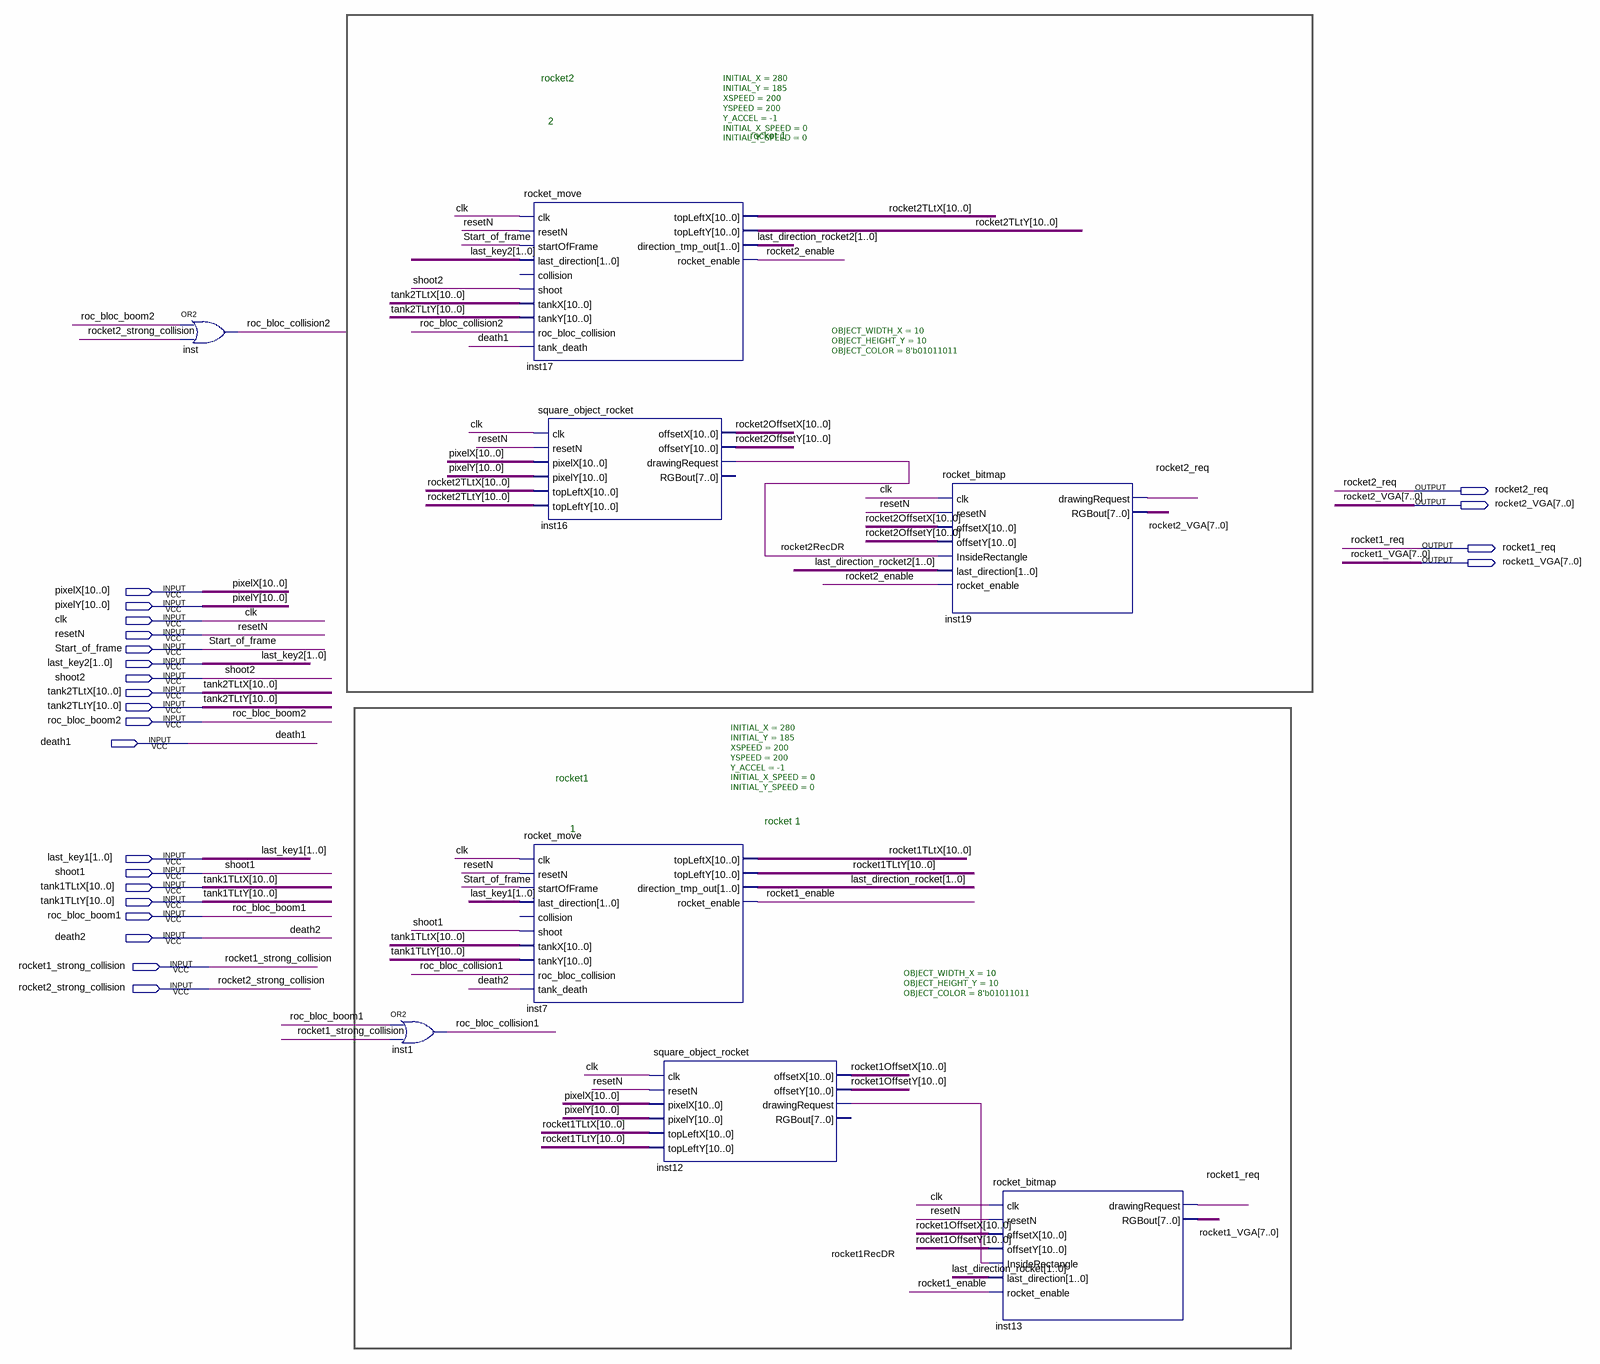
[diagram p0: schematic sheet]
// Quartus schematic rockets.bdf as structural Verilog: 8 symbols, 23 pins
module rockets (
  input  [10:0] pixelX,
  input  [10:0] pixelY,
  input  clk,
  input  resetN,
  input  Start_of_frame,
  input  [1:0] last_key2,
  input  shoot2,
  input  [10:0] tank2TLtX,
  input  [10:0] tank2TLtY,
  input  roc_bloc_boom2,
  input  death1,
  input  [1:0] last_key1,
  input  shoot1,
  input  [10:0] tank1TLtX,
  input  [10:0] tank1TLtY,
  input  roc_bloc_boom1,
  input  death2,
  input  rocket1_strong_collision,
  input  rocket2_strong_collision,
  output rocket2_req,
  output [7:0] rocket2_VGA,
  output rocket1_req,
  output [7:0] rocket1_VGA
);

  wire roc_bloc_collision1, roc_bloc_collision2, rocket1_enable, rocket1RecDR, rocket2_enable, rocket2RecDR;
  wire [1:0] last_direction_rocket, last_direction_rocket2;
  wire [10:0] rocket1OffsetX, rocket1OffsetY, rocket1TLtX, rocket1TLtY, rocket2OffsetX, rocket2OffsetY,
       rocket2TLtX, rocket2TLtY;

  or inst (roc_bloc_collision2, roc_bloc_boom2, rocket2_strong_collision);
  or inst1 (roc_bloc_collision1, roc_bloc_boom1, rocket1_strong_collision);
  rocket_move #(.INITIAL_X(280), .INITIAL_Y(185), .XSPEED(200), .YSPEED(200), .Y_ACCEL(-1), .INITIAL_X_SPEED(0), .INITIAL_Y_SPEED(0)) inst17 (
    .clk(clk), .resetN(resetN), .startOfFrame(Start_of_frame), .last_direction(last_key2), .shoot(shoot2),
    .tankX(tank2TLtX), .tankY(tank2TLtY), .roc_bloc_collision(roc_bloc_collision2), .tank_death(death1),
    .topLeftX(rocket2TLtX), .topLeftY(rocket2TLtY), .direction_tmp_out(last_direction_rocket2),
    .rocket_enable(rocket2_enable));  // open: collision
  square_object_rocket #(.OBJECT_WIDTH_X(10), .OBJECT_HEIGHT_Y(10), .OBJECT_COLOR(8'b01011011)) inst16 (
    .clk(clk), .resetN(resetN), .pixelX(pixelX), .pixelY(pixelY), .topLeftX(rocket2TLtX),
    .topLeftY(rocket2TLtY), .offsetX(rocket2OffsetX), .offsetY(rocket2OffsetY), .drawingRequest(rocket2RecDR));  // open: RGBout
  rocket_move #(.INITIAL_X(280), .INITIAL_Y(185), .XSPEED(200), .YSPEED(200), .Y_ACCEL(-1), .INITIAL_X_SPEED(0), .INITIAL_Y_SPEED(0)) inst7 (
    .clk(clk), .resetN(resetN), .startOfFrame(Start_of_frame), .last_direction(last_key1), .shoot(shoot1),
    .tankX(tank1TLtX), .tankY(tank1TLtY), .roc_bloc_collision(roc_bloc_collision1), .tank_death(death2),
    .topLeftX(rocket1TLtX), .topLeftY(rocket1TLtY), .direction_tmp_out(last_direction_rocket),
    .rocket_enable(rocket1_enable));  // open: collision
  square_object_rocket #(.OBJECT_WIDTH_X(10), .OBJECT_HEIGHT_Y(10), .OBJECT_COLOR(8'b01011011)) inst12 (
    .clk(clk), .resetN(resetN), .pixelX(pixelX), .pixelY(pixelY), .topLeftX(rocket1TLtX),
    .topLeftY(rocket1TLtY), .offsetX(rocket1OffsetX), .offsetY(rocket1OffsetY), .drawingRequest(rocket1RecDR));  // open: RGBout
  rocket_bitmap inst19 (
    .clk(clk), .resetN(resetN), .offsetX(rocket2OffsetX), .offsetY(rocket2OffsetY),
    .InsideRectangle(rocket2RecDR), .last_direction(last_direction_rocket2), .rocket_enable(rocket2_enable),
    .drawingRequest(rocket2_req), .RGBout(rocket2_VGA));
  rocket_bitmap inst13 (
    .clk(clk), .resetN(resetN), .offsetX(rocket1OffsetX), .offsetY(rocket1OffsetY),
    .InsideRectangle(rocket1RecDR), .last_direction(last_direction_rocket), .rocket_enable(rocket1_enable),
    .drawingRequest(rocket1_req), .RGBout(rocket1_VGA));

  // Notes on the sheet:
  //   rocket2
  //   2
  //   rocket 1
  //   rocket1
  //   rocket 1
  //   1
endmodule
